# Altium schematic sheet ATB-Ports.SchDoc
size A4
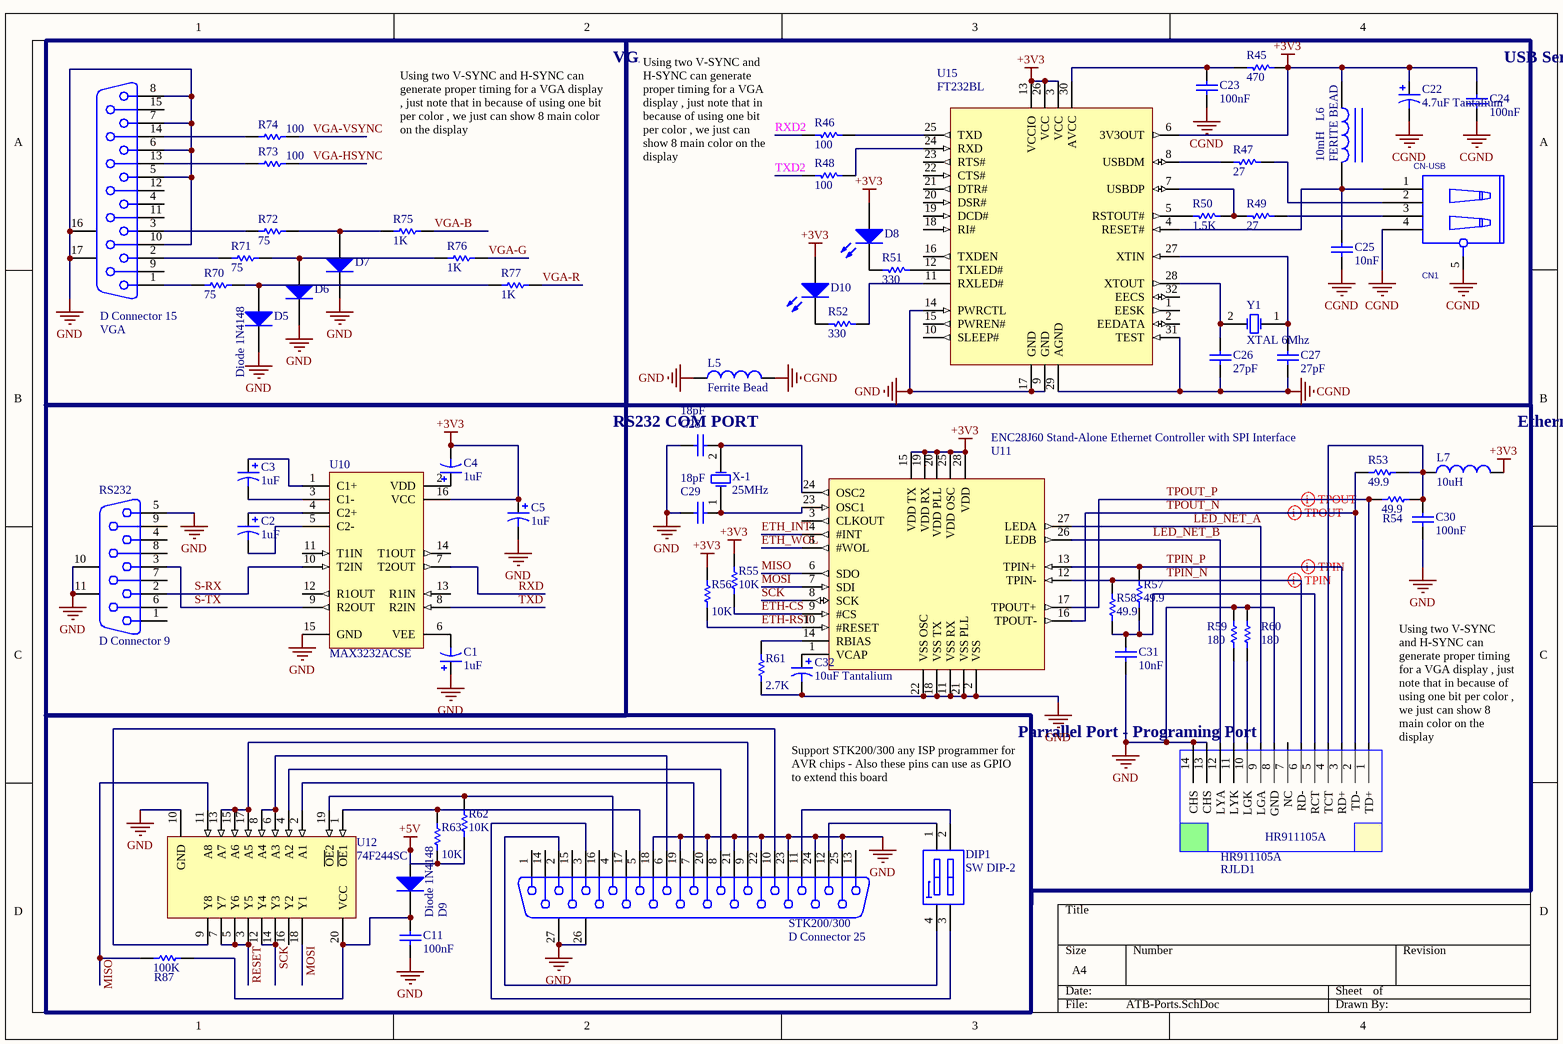
[diagram p0: ATB-Ports.SchDoc]

## Parts
C1  1uF  [SMD_C0805]
C2  1uF  [SMD_C0805]
C3  1uF  [SMD_C0805]
C4  1uF  [SMD_C0805]
C5  1uF  [SMD_C0805]
C11  100nF  [SMD_R0805]
C22  4.7uF Tantalium  [SMD_C3528-P]
C23  100nF  [SMD_C0805]
C24  100nF  [SMD_C0805]
C25  10nF  [SMD_C0805]
C26  27pF  [SMD_C0805]
C27  27pF  [SMD_C0805]
C28  18pF  [SMD_C0805]
C29  18pF  [SMD_C0805]
C30  100nF  [SMD_C0805]
C31  10nF  [SMD_C0805]
C32  10uF Tantalium  [SMD_C3528-P]
CN1  CN-USB  [USB-FEMALE]
D5  Diode 1N4148  [DL-35]
D6  Diode 1N4148  [DL-35]  (value not drawn)
D7  Diode 1N4148  [DL-35]  (value not drawn)
D8  LED0  [LED_0603_1608]  (value not drawn)
D9  Diode 1N4148  [DL-35]
D10  LED0  [LED_0603_1608]  (value not drawn)
DIP1  SW DIP-2  [DIP-4]
L5  Ferrite Bead  [SMD_C1206]
L6  FERITE BEAD  value 10mH  [SMD_R1206]
L7  10uH  [SMD_R0805]
R45  470  [SMD_R0805]
R46  100  [SMD_R0805]
R47  27  [SMD_R0805]
R48  100  [SMD_R0805]
R49  27  [SMD_R0805]
R50  1.5K  [SMD_R0805]
R51  330  [SMD_R0805]
R52  330  [SMD_R0805]
R53  49.9  [SMD_R0805]
R54  49.9  [SMD_R0805]
R55  10K  [SMD_R0805]
R56  10K  [SMD_R0805]
R57  49.9  [SMD_R0805]
R58  49.9  [SMD_R0805]
R59  180  [SMD_R0805]
R60  180  [SMD_R0805]
R61  2.7K  [SMD_R0805]
R62  10K  [SMD_R0805]
R63  10K  [SMD_R0805]
R70  75  [SMD_R0805]
R71  75  [SMD_R0805]
R72  75  [SMD_R0805]
R73  100  [SMD_R0805]
R74  100  [SMD_R0805]
R75  1K  [SMD_R0805]
R76  1K  [SMD_R0805]
R77  1K  [SMD_R0805]
R87  100K  [SMD_R0805]
RJLD1  HR911105A  [RJ45&LED]
RS232  D Connector 9  [DSUB1.385-2H9]
STK200/300  D Connector 25  [DSUB1.385-2H25A]
U10  MAX3232ACSE  [NSO16_N]
U11  ENC28J60 Stand-Alone Ethernet Controller with SPI Interface  [SOIC127P1030X224-28M]
U12  74F244SC  [M20B_N]
U15  FT232BL  [LQFP-32_N]
VGA  D Connector 15  [D-Sub-H.D-Right-15]
X-1  25MHz  [XTALL-SMD]
Y1  XTAL 6Mhz  [XTALL]

## Blocks framed on the sheet
VGA PORT: D5-D7 R70-R77 VGA
USB Serial PORT: C22-C27 CN1 D8 D10 L5 L6 R45-R52 U15 Y1
RS232 COM PORT: C1-C5 RS232 U10
Parrallel Port - Programing Port: C11 D9 DIP1 R62 R63 R87 STK200/300 U12

## Nets
+3V3: C4.2 C5.1 C22.1 C24.1 D8.1(A) D10.1(A) L6.2 L7.2 R45.1 R55.2 R56.2 U10.16(VCC) U11.15(VDD_TX) U11.19(VDD_RX) U11.20(VDD_PLL) U11.25(VDD_OSC) U11.28(VDD) U15.3(VCC) U15.6(3V3OUT) U15.13(VCCIO) U15.26(VCC)
+5V: D9.1(A) R62.1 R63.1
CGND: C22.2 C23.1 C24.2 C25.1 C26.1 C27.1 CN1.4 CN1.5 L5.2 U15.29(AGND) U15.31(TEST)
GND: C1.1 C5.2 C11.1 C28.1 C29.1 C30.2 C31.1 C32.2 D5.2(K) D6.2(K) D7.2(K) L5.1 R59.1 R60.1 R61.1 RJLD1.8(GND) RJLD1.13(CHS) RJLD1.14(CHS) RS232.5 RS232.10(MH1) RS232.11(MH2) STK200/300.18 STK200/300.19 STK200/300.20 STK200/300.21 STK200/300.22 STK200/300.23 STK200/300.24 STK200/300.25 STK200/300.26(MH1) STK200/300.27(MH2) U10.15(GND) U11.2(VSS) U11.11(VSS_RX) U11.18(VSS_TX) U11.21(VSS_PLL) U11.22(VSS_OSC) U12.10(GND) U15.9(GND) U15.14(PWRCTL) U15.17(GND) VGA.5 VGA.6 VGA.7 VGA.8 VGA.10 VGA.16(MH1) VGA.17(MH2)
ETH-CS: R55.1 U11.9(#CS)
ETH-RST: R56.1 U11.10(#RESET)
ETH_INT: U11.4(#INT)
ETH_WOL: U11.5(#WOL)
LED_NET_A: RJLD1.9(LGA) U11.27(LEDA)
LED_NET_B: RJLD1.12(LYA) U11.26(LEDB)
MISO: R87.1 U11.6(SDO) U12.11(A8)
MOSI: U11.7(SDI) U12.18(Y1)
RESET: U12.3(Y5) U12.5(Y6) U12.7(Y7)
RXD: U10.7(T2OUT)
RXD2: R46.2
S-RX: RS232.2 U10.10(T2IN)
S-TX: RS232.3 U10.9(R2OUT)
SCK: U11.8(SCK) U12.12(Y4) U12.14(Y3)
TPIN_N: R58.2 RJLD1.6(RD-) U11.12(TPIN-)
TPIN_P: R57.2 RJLD1.3(RD+) U11.13(TPIN+)
TPOUT_N: R53.1 RJLD1.2(TD-) U11.16(TPOUT-)
TPOUT_P: R54.1 RJLD1.1(TD+) U11.17(TPOUT+)
TXD: U10.8(R2IN)
TXD2: R48.1
VGA-B: R75.2
VGA-G: R76.2
VGA-HSYNC: R73.2
VGA-R: R77.2
VGA-VSYNC: R74.2
NetC1_2: C1.2 U10.6(VEE)
NetC2_1: C2.1 U10.4(C2+)
NetC2_2: C2.2 U10.5(C2-)
NetC3_1: C3.1 U10.1(C1+)
NetC3_2: C3.2 U10.3(C1-)
NetC4_1: C4.1 U10.2(VDD)
NetC11_2: C11.2 D9.2(K) R87.2 U12.20(VCC)
NetC23_2: C23.2 R45.2 U15.30(AVCC)
NetC25_2: C25.2 CN1.1 L6.1 U15.4(RESET#)
NetC26_2: C26.2 U15.28(XTOUT) Y1.2(OSC2)
NetC27_2: C27.2 U15.27(XTIN) Y1.1(OSC1)
NetC28_2: C28.2 U11.24(OSC2) X-1.2(OSC2)
NetC29_2: C29.2 U11.23(OSC1) X-1.1(OSC1)
NetC30_1: C30.1 L7.1 R53.2 R54.2 RJLD1.4(TCT)
NetC31_2: C31.2 R57.1 R58.1 RJLD1.5(RCT)
NetC32_1: C32.1 U11.1(VCAP)
NetCN1_2: CN1.2 R47.1
NetCN1_3: CN1.3 R49.1
NetD5_1: D5.1(A) R70.2 R77.1
NetD6_1: D6.1(A) R71.2 R76.1
NetD7_1: D7.1(A) R72.2 R75.1
NetD8_2: D8.2(K) R51.2
NetD10_2: D10.2(K) R52.2
NetDIP1_1: DIP1.1(A1) STK200/300.12
NetDIP1_2: DIP1.2(A2) STK200/300.11
NetDIP1_3: DIP1.3(B2) STK200/300.3
NetDIP1_4: DIP1.4(B1) STK200/300.2
NetR46_1: R46.1 U15.25(TXD)
NetR47_2: R47.2 U15.8(USBDM)
NetR48_2: R48.2 U15.24(RXD)
NetR49_2: R49.2 R50.1 U15.7(USBDP)
NetR50_2: R50.2 U15.5(RSTOUT#)
NetR51_1: R51.1 U15.12(TXLED#)
NetR52_1: R52.1 U15.11(RXLED#)
NetR59_2: R59.2 RJLD1.11(LYK)
NetR60_2: R60.2 RJLD1.10(LGK)
NetR61_2: R61.2 U11.14(RBIAS)
NetR62_2: R62.2 STK200/300.4 U12.19(~{OE}2)
NetR63_2: R63.2 STK200/300.5 U12.1(~{OE}1)
NetR70_1: R70.1 VGA.1
NetR71_1: R71.1 VGA.2
NetR72_1: R72.1 VGA.3
NetR73_1: R73.1 VGA.13
NetR74_1: R74.1 VGA.14
NetSTK200/300_6: STK200/300.6 U12.6(A3) U12.8(A4)
NetSTK200/300_7: STK200/300.7 U12.2(A1)
NetSTK200/300_8: STK200/300.8 U12.4(A2)
NetSTK200/300_9: STK200/300.9 U12.13(A7) U12.15(A6) U12.17(A5)
NetSTK200/300_10: STK200/300.10 U12.9(Y8)

Not connected (* = marked no-connect by the designer): RJLD1 7(NC); RS232 1 4 6 7 8 9; STK200/300 1 13 14 15 16 17; U10 11(T1IN) 12(R1OUT) 13(R1IN) 14(T1OUT); U11 3(CLKOUT); U12 16(Y2); U15 1(EESK) 2(EEDATA) 10(SLEEP#) 15(PWREN#) 16(TXDEN) 18(RI#) 19(DCD#) 20(DSR#) 21(DTR#) 22(CTS#) 23(RTS#) 32(EECS); VGA 4 9 11 12 15

## Layout directives
differential pair: TPIN_N, TPIN_P, TPOUT_N, TPOUT_P

## Notes on the sheet
- Using two V-SYNC and H-SYNC can generate proper timing for a VGA display , just note that in because of using one bit per color , we just can show 8 main color on the display
- Ethernet PORT
- Support STK200/300 any ISP programmer for AVR chips - Also these pins can use as GPIO to extend this board
- (near RJLD1) Using two V-SYNC and H-SYNC can generate proper timing for a VGA display , just note that in because of using one bit per color , we just can show 8 main color on the display

## Library data of the parts
C1-C5 C22 C32 = Cap Pol1: Polarized Capacitor (Radial); Published: 8-Jun-2000; LatestRevisionDate: 17-Jul-2002; LatestRevisionNote: Re-released for DXP Platform.; PackageReference: RB7.6-15; Publisher: Altium Limited
  C1-C5: Value: 1uF
  C22: PackageDescription: Polarized Capacitor (Radial); 2 Leads; Value: 4.7uF
  C32: Value: 10uF
C11 C23-C31 = Cap: Capacitor; Published: 8-Jun-2000; LatestRevisionDate: 17-Jul-2002; LatestRevisionNote: Re-released for DXP Platform.; PackageReference: RAD-0.3; Publisher: Altium Limited
  C11 C30: Value: 100nF
  C23 C24: PackageDescription: Radial Cap, Thru-Hole; 2 Leads; 0.3 in Pin Spacing; Value: 100nF
  C25: PackageDescription: Radial Cap, Thru-Hole; 2 Leads; 0.3 in Pin Spacing; Value: 10nF
  C26 C27: PackageDescription: Radial Cap, Thru-Hole; 2 Leads; 0.3 in Pin Spacing; Value: 27pF
  C28 C29: Value: 18pF
  C31: Value: 10nF
CN1 = CN-USB: Right: 60; Bottom: 60
D5-D7 D9 = Diode 1N4148: High Conductance Fast Diode; Published: 8-Jun-2000; LatestRevisionDate: 17-Jul-2002; LatestRevisionNote: Re-released for DXP Platform.; DatasheetDocument: 1997; PackageReference: DO-35; Publisher: Altium Limited; Code_JEDEC: DO-204-AH; ComponentLink1Description: Manufacturer Link; ComponentLink1URL: http://www.fairchildsemi.com/; ComponentLink2Description: Datasheet; ComponentLink2URL: http://www.fairchildsemi.com/ds/1N%2F1N4148.pdf
D8 D10 = LED0: Typical INFRARED GaAs LED; Published: 8-Jun-2000; LatestRevisionDate: 08-Jul-2005; LatestRevisionNote: Mech Layer 1 removed.; PackageReference: LED-0; Publisher: Altium Limited; PackageDescription: LED; 2 Leads
DIP1 = SW DIP-2: DIP Switch, 2 Position, SPST; Published: 24-Mar-1999; LatestRevisionDate: 17-Jul-2002; LatestRevisionNote: Re-released for DXP Platform.; PackageReference: DIP-4; Publisher: Altium Limited
L5 = Inductor: Code_IEC: 1005; Value: 10mH; Published: 8-Jun-2000; LatestRevisionDate: 29-May-2009; LatestRevisionNote: IPC-7351 Footprint Added.; PackageReference: 0402-A; Publisher: Altium Limited; PackageDescription: Chip Inductor; Code_JEITA: 0402
L6 = Inductor Iron: Magnetic-Core Inductor; Published: 24-Mar-1999; LatestRevisionDate: 17-Jul-2002; LatestRevisionNote: Re-released for DXP Platform.; PackageReference: AXIAL-0.9; Publisher: Altium Limited; PackageDescription: Axial Device, Thru-Hole; 2 Leads; 0.9 in Pin Spacing
L7 = Inductor: Code_IEC: 1005; Published: 8-Jun-2000; LatestRevisionDate: 17-Jul-2002; LatestRevisionNote: Re-released for DXP Platform.; PackageReference: 0402-A; Publisher: Altium Limited; Code_JEITA: 0402; Value: 10uH
R45-R50 R53-R63 R70-R77 R87 = Res1: Resistor; Published: 8-Jun-2000; LatestRevisionDate: 17-Jul-2002; LatestRevisionNote: Re-released for DXP Platform.; PackageReference: AXIAL-0.3; Publisher: Altium Limited
  R45: PackageDescription: Axial Device, Thru-Hole; 2 Leads; 0.3 in Pin Spacing; Value: 470
  R46 R48: PackageDescription: Axial Device, Thru-Hole; 2 Leads; 0.3 in Pin Spacing; Value: 100
  R47 R49: PackageDescription: Axial Device, Thru-Hole; 2 Leads; 0.3 in Pin Spacing; Value: 27
  R50: PackageDescription: Axial Device, Thru-Hole; 2 Leads; 0.3 in Pin Spacing; Value: 1.5K
  R53 R54 R57 R58: Value: 49.9
  R55 R56 R62 R63: Value: 10K
  R59 R60: Value: 180
  R61: Value: 2.7K
  R70-R72: Value: 75
  R73 R74: Value: 100
  R75-R77: Value: 1K
  R87: Value: 100K
R51 R52 = Res1: Resistor; Value: 220; Published: 8-Jun-2000; LatestRevisionDate: 17-Jul-2002; LatestRevisionNote: Re-released for DXP Platform.; PackageReference: AXIAL-0.3; Publisher: Altium Limited; PackageDescription: Axial Device, Thru-Hole; 2 Leads; 0.3 in Pin Spacing
RJLD1 = RJLD043TC1
RS232 = D Connector 9: Receptacle Assembly, 9 Position, Right Angle; PackageDocument: O; Positions: 9; Published: 15-Jun-2001; LatestRevisionDate: 17-Jul-2002; LatestRevisionNote: Re-released for DXP Platform.; DatasheetDocument: 1-Sep-1999; PackageReference: 788750; Publisher: Altium Limited; Orientation: Right Angle; Gender: Receptacle
STK200/300 = D Connector 25: Receptacle Assembly, 25 Position, Right Angle; PackageDocument: U; Positions: 25; Published: 15-Jun-2001; LatestRevisionDate: 17-Jul-2002; LatestRevisionNote: Re-released for DXP Platform.; DatasheetDocument: 19-Mar-1999; PackageReference: 787202; Publisher: Altium Limited; Orientation: Right Angle; Gender: Receptacle
U10 = MAX232ACSE: +5V Powered, Multi-Channel RS-232 Driver/Receiver; Published: 16-Jan-2001; LatestRevisionDate: 13-Apr-2006; LatestRevisionNote: IPC-7351 Footprint Added.; PackageReference: NSO16; Publisher: Altium Limited; PackageDescription: 16-Pin Small Outline Integrated Circuit 1.27 mm Pitch; Code_JEDEC: MS-012-AC; Code_IPC: SOIC127P600-16; ComponentLink1Description: Manufacturer Link; ComponentLink1URL: http://www.maxim-ic.com/; ComponentLink2Description: Datasheet; ComponentLink2URL: http://pdfserv.maxim-ic.com/en/ds/MAX220-MAX249.pdf
U11 = ENC29J60
U12 = 74F244SC: Octal Buffer/Line Driver with Tri-State Output; Published: 15-Apr-2002; LatestRevisionDate: 13-Apr-2006; LatestRevisionNote: IPC-7351 Footprint Added.; DatasheetVersion: May-1995; PackageVersion: 2000; PackageReference: M20B; Publisher: Altium Limited; PackageDescription: 20-Pin Small Outline Integrated Circuit 1.27 mm Pitch; Code_JEDEC: MS-013-AC; Code_IPC: SOIC127P1030-20; ComponentLink1Description: Manufacturer Link; ComponentLink1URL: http://www.national.com/; ComponentLink2Description: Datasheet; ComponentLink2URL: http://www.fairchildsemi.com/ds/74/74F244.pdf; ComponentLink3Description: URL Link1; ComponentLink3URL: http://www.fairchildsemi.com/pf/74/74F244.html
U15 = FT232BL: USB UART Asynchronous Serial Data Transfer Chip, LQFP-32, Pb-Free; Published: 6-Oct-2005; LatestRevisionDate: 13-Apr-2006; LatestRevisionNote: IPC-7351 Footprint Added.; DatasheetVersion: ver 1.8, Dec-2005; PackageVersion: 2004; PackageReference: LQFP-32; Publisher: Altium Limited; PackageDescription: 32-Pin Thin Quad Flat Pack 0.8 mm Pitch; ComponentLink1Description: Manufacturer Link; ComponentLink1URL: http://www.ftdichip.com/Products/ICs/FT232B.htm; ComponentLink2Description: Datasheet; ComponentLink2URL: http://www.ftdichip.com/Support/Documents/DataSheets/ICs/DS_FT232BL.pdf
VGA = D Connector 15: Receptacle Assembly, 15 Position, Right Angle; PackageDocument: O; Positions: 15; Published: 15-Jun-2001; LatestRevisionDate: 17-Jul-2002; LatestRevisionNote: Re-released for DXP Platform.; DatasheetDocument: 1-Sep-99; PackageReference: 788757; Publisher: Altium Limited; Orientation: Right Angle; Gender: Receptacle
X-1 Y1 = XTAL: Crystal Oscillator; Published: 8-Jun-2000; LatestRevisionDate: 17-Jul-2002; LatestRevisionNote: Re-released for DXP Platform.; PackageReference: R38; Publisher: Altium Limited
  Y1: PackageDescription: Crystal, Thru-Hole; 2 Leads; Body 3.1 x 8.2 mm (Dia.xH)